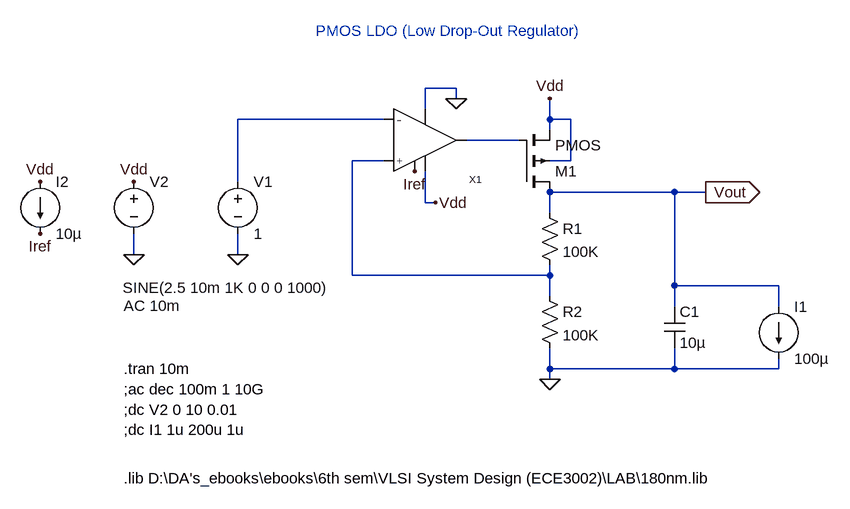
[diagram p0: schematic PMOS_LDO.asc]
PMOS_LDO.asc, the LTspice schematic file:
Version 4
SHEET 1 880 724
WIRE 288 80 240 80
WIRE 288 96 288 80
WIRE 240 112 240 80
WIRE 176 128 -48 128
WIRE 432 128 432 96
WIRE 464 128 432 128
WIRE 432 144 432 128
WIRE 384 160 304 160
WIRE 176 192 128 192
WIRE 464 192 464 128
WIRE 464 192 432 192
WIRE -48 224 -48 128
WIRE 624 240 432 240
WIRE 672 240 624 240
WIRE 240 256 240 208
WIRE 256 256 240 256
WIRE 432 272 432 240
WIRE -208 336 -208 304
WIRE -48 336 -48 304
WIRE 128 368 128 192
WIRE 432 368 432 352
WIRE 432 368 128 368
WIRE 624 384 624 240
WIRE 784 384 624 384
WIRE 432 400 432 368
WIRE 624 416 624 384
WIRE 784 416 784 384
WIRE 432 512 432 480
WIRE 624 512 624 480
WIRE 624 512 432 512
WIRE 784 512 784 496
WIRE 784 512 624 512
WIRE 432 528 432 512
FLAG -48 336 0
FLAG 432 528 0
FLAG -208 336 0
FLAG -208 224 Vdd
FLAG 432 96 Vdd
FLAG 288 96 0
FLAG 256 256 Vdd
FLAG 672 240 Vout
IOPIN 672 240 Out
FLAG -352 304 Iref
FLAG -352 224 Vdd
FLAG 224 208 Iref
SYMBOL pmos4 384 240 M180
SYMATTR InstName M1
SYMATTR Value2 l=180n w=1.8u
SYMBOL voltage -48 208 R0
WINDOW 123 0 0 Left 0
WINDOW 39 0 0 Left 0
SYMATTR InstName V1
SYMATTR Value 1
SYMBOL res 416 256 R0
SYMATTR InstName R1
SYMATTR Value 100K
SYMBOL res 416 384 R0
SYMATTR InstName R2
SYMATTR Value 100K
SYMBOL cap 608 416 R0
SYMATTR InstName C1
SYMATTR Value 10µ
SYMBOL voltage -208 208 R0
WINDOW 3 -17 179 Left 2
WINDOW 123 -16 207 Left 2
WINDOW 39 0 0 Left 0
SYMATTR Value SINE(2.5 10m 1K 0 0 0 1000)
SYMATTR Value2 AC 10m
SYMATTR InstName V2
SYMBOL current 784 416 R0
WINDOW 123 0 0 Left 0
WINDOW 39 0 0 Left 0
SYMATTR InstName I1
SYMATTR Value 100µ
SYMBOL Two_Stage_CMOS_Op_Amp 224 160 M180
SYMATTR InstName X1
SYMBOL current -352 224 R0
WINDOW 123 0 0 Left 0
WINDOW 39 0 0 Left 0
SYMATTR InstName I2
SYMATTR Value 10µ
TEXT -224 680 Left 2 !.lib D:\\DA's_ebooks\\ebooks\\6th sem\\VLSI System Design (ECE3002)\\LAB\\180nm.lib
TEXT -224 512 Left 2 !.tran 10m\n;ac dec 100m 1 10G\n;dc V2 0 10 0.01\n;dc I1 1u 200u 1u
TEXT 72 -8 Left 2 ;PMOS LDO (Low Drop-Out Regulator)

The netlist it stands for:
* PMOS_LDO.asc
M1 Vout N002 Vdd Vdd PMOS l=180n w=1.8u
V1 N001 0 1
R1 Vout N003 100K
R2 N003 0 100K
C1 Vout 0 10µ
V2 Vdd 0 SINE(2.5 10m 1K 0 0 0 1000) AC 10m
I1 Vout 0 100µ
XX1 Vdd 0 N003 N001 N002 Iref Two_Stage_CMOS_Op_Amp  ; pins Vdd Vss V+ V- Vout Iref
I2 Vdd Iref 10µ
.model NMOS NMOS
.model PMOS PMOS
.lib standard.mos
.lib D:\DA's_ebooks\ebooks\6th sem\VLSI System Design (ECE3002)\LAB\180nm.lib
.tran 10m
;ac dec 100m 1 10G
;dc V2 0 10 0.01
;dc I1 1u 200u 1u
* PMOS LDO (Low Drop-Out Regulator)
.backanno
.end